# EAGLE schematic V1 (EAGLE 9.6.0)
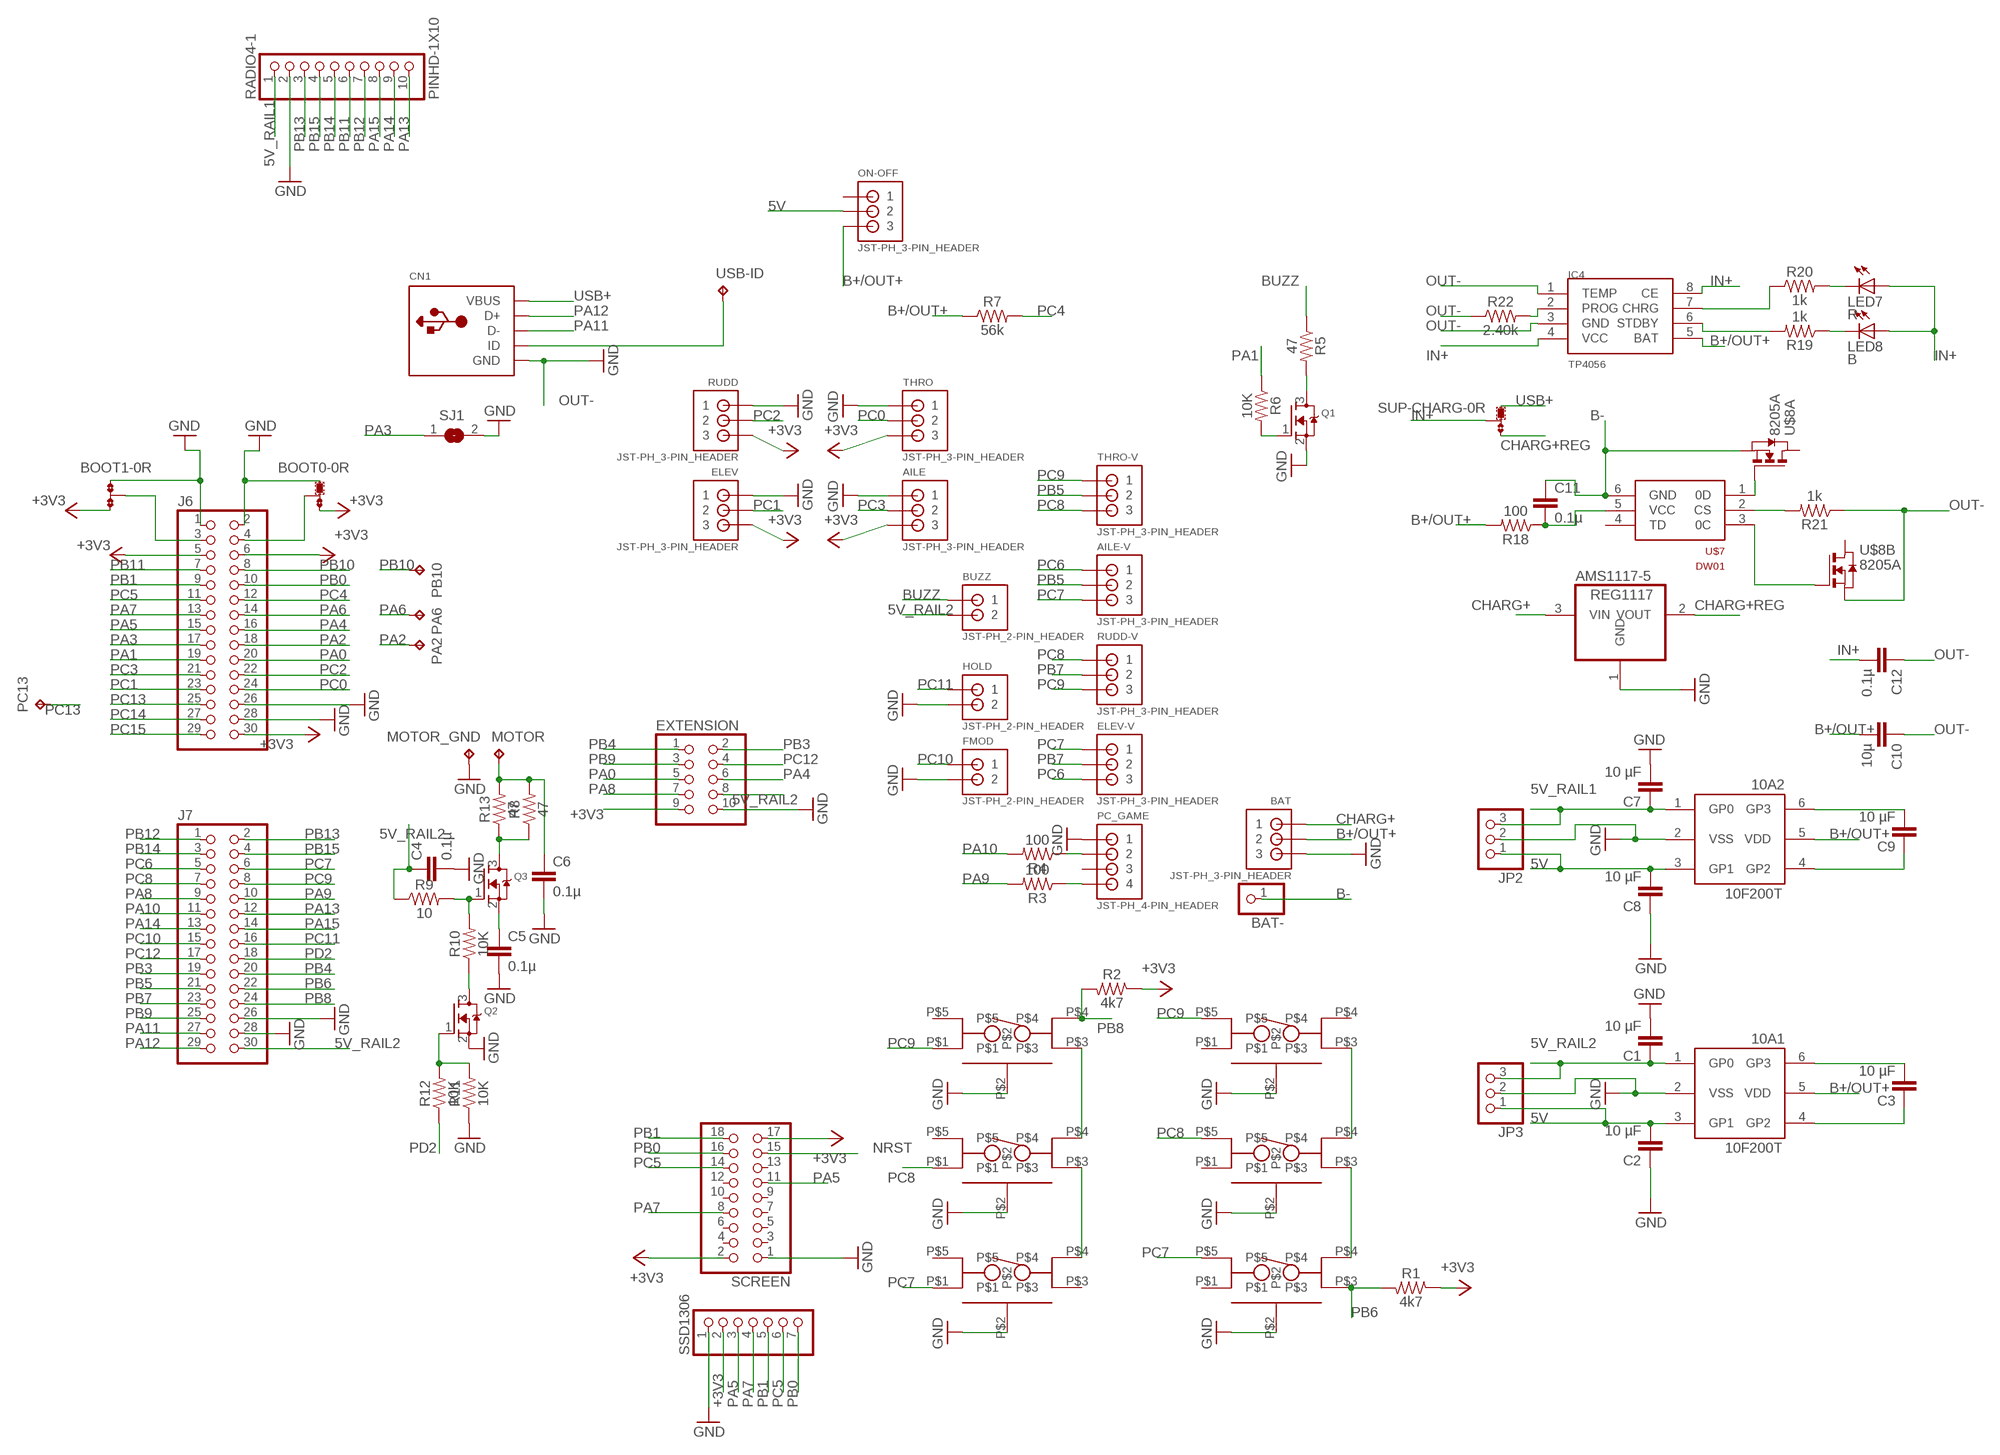
[diagram p0: schematic, sheet 1]

## Parts
10A1  10F200T  [SOT23-6]
10A2  10F200T  [SOT23-6]
AILE  JST-PH_3-PIN_HEADER  [JST_B3B-PH_HEADER]
AILE-V  JST-PH_3-PIN_HEADER  [JST_B3B-PH_HEADER]
AMS1117-5  REG1117  [SOT223]
BAT  JST-PH_3-PIN_HEADER  [JST_B3B-PH_HEADER]
BAT-  PINHD-1X1  [1X01]
BOOT0  0R-JUMPC  [C0R-JMP]
BOOT1  0R-JUMPC  [C0R-JMP]
BUZZ  JST-PH_2-PIN_HEADER  [JST_B2B-PH_HEADER]
C1  10 µF  CC0603  [C0603]
C2  10 µF  CC0603  [C0603]
C3  10 µF  CC0603  [C0603]
C4  0.1µ  C-EUC0603  [C0603]
C5  0.1µ  C-EUC0603  [C0603]
C6  0.1µ  C-EUC0603  [C0603]
C7  10 µF  CC0603  [C0603]
C8  10 µF  CC0603  [C0603]
C9  10 µF  CC0603  [C0603]
C10  10µ  C-EUC0603  [C0603]
C11  0.1µ  C-EUC0603  [C0603]
C12  0.1µ  C-EUC0603  [C0603]
CN1  USBMINIB  [USB-MINIB]
DN-  TS-1262V-5  [TS-1262V-5]
ELEV  JST-PH_3-PIN_HEADER  [JST_B3B-PH_HEADER]
ELEV-V  JST-PH_3-PIN_HEADER  [JST_B3B-PH_HEADER]
ENT  TS-1262V-5  [TS-1262V-5]
EXT  TS-1262V-5  [TS-1262V-5]
EXTENSION  PINHD-2X5  [2X05]
FMOD  JST-PH_2-PIN_HEADER  [JST_B2B-PH_HEADER]
HOLD  JST-PH_2-PIN_HEADER  [JST_B2B-PH_HEADER]
IC4  TP4056  [SOP-8]
J6  PINHD-2X15  [2X15]
J7  PINHD-2X15  [2X15]
JP2  PINHD-1X3  [1X03]
JP3  PINHD-1X3  [1X03]
L-  TS-1262V-5  [TS-1262V-5]
LED7  R  LEDCHIP-LED0603  [CHIP-LED0603]
LED8  B  LEDCHIP-LED0603  [CHIP-LED0603]
MOTOR  TPTP20R  [TP20R]
MOTOR_GND  TPTP20R  [TP20R]
ON-OFF  JST-PH_3-PIN_HEADER  [JST_B3B-PH_HEADER]
PA2  TPTP20R  [TP20R]
PA6  TPTP20R  [TP20R]
PB10  TPTP20R  [TP20R]
PC13  TPTP20R  [TP20R]
PC_GAME  JST-PH_4-PIN_HEADER  [JST_B4B-PH_HEADER]
Q1  MOSFET-NREFLOW  [SOT23]
Q2  MOSFET-NREFLOW  [SOT23]
Q3  MOSFET-NREFLOW  [SOT23]
R1  4k7  1KOHM-0603-1/10W-1%  [0603]
R2  4k7  1KOHM-0603-1/10W-1%  [0603]
R3  100  100OHM-0603-1/4W-5%  [0603]
R4  100  100OHM-0603-1/4W-5%  [0603]
R5  47  100OHM-0603-1/4W-5%  [0603]
R6  10K  100OHM-0603-1/4W-5%  [0603]
R7  56k  100OHM-0603-1/4W-5%  [0603]
R8  47  100OHM-0603-1/4W-5%  [0603]
R9  10  100OHM-0603-1/4W-5%  [0603]
R10  10K  100OHM-0603-1/4W-5%  [0603]
R11  10K  100OHM-0603-1/4W-5%  [0603]
R12  10K  100OHM-0603-1/4W-5%  [0603]
R13  47  100OHM-0603-1/4W-5%  [0603]
R18  100  100OHM-0603-1/4W-5%  [0603]
R19  1k  1KOHM-0603-1/10W-1%  [0603]
R20  1k  1KOHM-0603-1/10W-1%  [0603]
R21  1k  1KOHM-0603-1/10W-1%  [0603]
R22  2.40k  1.20KOHM-0603-1/10W-1%  [0603]
R+  TS-1262V-5  [TS-1262V-5]
RADIO4-1  PINHD-1X10  [1X10-BIG]
RUDD  JST-PH_3-PIN_HEADER  [JST_B3B-PH_HEADER]
RUDD-V  JST-PH_3-PIN_HEADER  [JST_B3B-PH_HEADER]
SCREEN  PINHD-2X9  [2X09]
SJ1  SJ  [SJ]
SSD1306  PINHD-1X7  [1X07]
SUP-CHARG  0R-JUMPC  [C0R-JMP]
THRO  JST-PH_3-PIN_HEADER  [JST_B3B-PH_HEADER]
THRO-V  JST-PH_3-PIN_HEADER  [JST_B3B-PH_HEADER]
U$7  DW01  [SOT23-6]
U$8  8205A  [TSSOP8]
UP+  TS-1262V-5  [TS-1262V-5]
USB-ID  TPTP20R  [TP20R]

## Nets
5V: 10A1.3(GP1) 10A2.3(GP1) C2.2 C8.2 JP2.1 JP3.1 ON-OFF.P2
5V_RAIL1: 10A2.1(GP0) C7.1 JP2.3 RADIO4-1.1
5V_RAIL2: 10A1.1(GP0) BUZZ.P2 C1.1 C4.1 EXTENSION.8 J7.30 JP3.3 R9.1
+3V3: AILE.P3 BOOT0.3 BOOT1.3 ELEV.P3 EXTENSION.9 J6.5 J6.6 J6.30 R1.1 R2.1 RUDD.P3 SCREEN.2 SCREEN.17 SSD1306.2 THRO.P3
B+/OUT+: 10A1.5(VDD) 10A2.5(VDD) BAT.P2 C10.2 IC4.5(BAT) ON-OFF.P3 R7.1 R18.2
B-: BAT-.1 C11.1 U$7.6(GND) U$8.2(A:S) U$8.3(A:S)
BUZZ: BUZZ.P1 R5.1
CHARG+: AMS1117-5.3(VIN) BAT.P1
CHARG+REG: AMS1117-5.2(VOUT) SUP-CHARG.3
GND: 10A1.2(VSS) 10A2.2(VSS) AILE.P1 AMS1117-5.1(GND) BAT.P3 BOOT0.1 BOOT1.1 C1.2 C2.1 C4.2 C5.2 C6.2 C7.2 C8.1 DN-.P$2 ELEV.P1 ENT.P$2 EXT.P$2 EXTENSION.10 FMOD.P2 HOLD.P2 J6.1 J6.2 J6.26 J6.28 J7.26 J7.28 JP2.2 JP3.2 L-.P$2 MOTOR_GND.TP PC_GAME.P1 Q1.2(S) Q2.2(S) R11.1 R+.P$2 RADIO4-1.2 RUDD.P1 SCREEN.1 SJ1.2 SSD1306.1 THRO.P1 UP+.P$2
IN+: C12.2 IC4.4(VCC) IC4.8(CE) LED7.A LED8.A SUP-CHARG.2
N$1: DN-.P$4 UP+.P$3
N$2: BOOT0.2 J6.4
N$3: BOOT1.2 J6.3
N$4: EXT.P$3 UP+.P$4
N$5: ENT.P$4 R+.P$3
N$6: L-.P$3 R+.P$4
N$7: 10A1.6(GP3) C3.2
N$8: Q2.3(D) R10.1
N$9: 10A1.4(GP2) C3.1
N$10: Q3.1(G) R9.2 R10.2
N$11: Q2.1(G) R11.2 R12.2
N$12: CN1.ID USB-ID.TP
N$13: PC_GAME.P2 R4.1
N$14: PC_GAME.P4 R3.1
N$15: Q1.3(D) R5.2
N$16: Q1.1(G) R6.2
N$17: C6.1 MOTOR.TP R8.2 R13.2
N$18: Q3.3(D) R8.1 R13.1
N$19: 10A2.6(GP3) C9.2
N$20: C5.1 Q3.2(S)
N$21: 10A2.4(GP2) C9.1
N$34: LED8.C R19.1
N$35: U$7.1(0D) U$8.4(A:G)
N$36: U$7.3(0C) U$8.5(B:G)
N$37: R21.2 U$7.2(CS)
N$38: C11.2 R18.1 U$7.5(VCC)
N$39: IC4.6(STDBY) R19.2
N$40: IC4.7(CHRG) R20.1
N$41: LED7.C R20.2
N$42: IC4.2(PROG) R22.2
NRST: SCREEN.15
OUT-: C10.1 C12.1 CN1.GND IC4.1(TEMP) IC4.3(GND) R21.1 R22.1 U$8.6(B:S) U$8.7(B:S) ; supply symbol labelled GND
PA0: EXTENSION.5 J6.20
PA1: J6.19 R6.1
PA2: J6.18 PA2.TP
PA3: J6.17 SJ1.1
PA4: EXTENSION.6 J6.16
PA5: J6.15 SCREEN.11 SSD1306.3
PA6: J6.14 PA6.TP
PA7: J6.13 SCREEN.8 SSD1306.4
PA8: EXTENSION.7 J7.9
PA9: J7.10 R3.2
PA10: J7.11 R4.2
PA11: CN1.D- J7.27
PA12: CN1.D+ J7.29
PA13: J7.12 RADIO4-1.10
PA14: J7.13 RADIO4-1.9
PA15: J7.14 RADIO4-1.8
PB0: J6.10 SCREEN.16 SSD1306.7
PB1: J6.9 SCREEN.18 SSD1306.5
PB3: EXTENSION.2 J7.19
PB4: EXTENSION.1 J7.20
PB5: AILE-V.P2 J7.21 THRO-V.P2
PB6: ENT.P$3 J7.22 R1.2
PB7: ELEV-V.P2 J7.23 RUDD-V.P2
PB8: EXT.P$4 J7.24 R2.2
PB9: EXTENSION.3 J7.25
PB10: J6.8 PB10.TP
PB11: J6.7 RADIO4-1.6
PB12: J7.1 RADIO4-1.7
PB13: J7.2 RADIO4-1.3
PB14: J7.3 RADIO4-1.5
PB15: J7.4 RADIO4-1.4
PC0: J6.24 THRO.P2
PC1: ELEV.P2 J6.23
PC2: J6.22 RUDD.P2
PC3: AILE.P2 J6.21
PC4: J6.12 R7.2
PC5: J6.11 SCREEN.14 SSD1306.6
PC6: AILE-V.P1 ELEV-V.P3 J7.5
PC7: AILE-V.P3 DN-.P$1 ELEV-V.P1 ENT.P$5 J7.6
PC8: J7.7 R+.P$5 RUDD-V.P1 THRO-V.P3 UP+.P$1
PC9: EXT.P$1 J7.8 L-.P$5 RUDD-V.P3 THRO-V.P1
PC10: FMOD.P1 J7.15
PC11: HOLD.P1 J7.16
PC12: EXTENSION.4 J7.17
PC13: J6.25 PC13.TP
PC14: J6.27
PC15: J6.29
PD2: J7.18 R12.1
USB+: CN1.VBUS SUP-CHARG.1
Unconnected: DN-.P$3 DN-.P$5 ENT.P$1 EXT.P$5 L-.P$1 L-.P$4 ON-OFF.P1 PC_GAME.P3 R+.P$1 SCREEN.3 SCREEN.4 SCREEN.5 SCREEN.6 SCREEN.7 SCREEN.9 SCREEN.10 SCREEN.12 SCREEN.13 U$7.4(TD) U$8.1(A:D) U$8.8(B:D) UP+.P$5

## Library data of the parts
10A1 10A2 = adafruit:10F200T: PIC10F200/202/204/206 Ultra-small 8-bit PIC micros in SOT-23-6 and SOIC
AILE AILE-V BAT ELEV ELEV-V ON-OFF RUDD RUDD-V THRO THRO-V = srg:JST-PH_3-PIN_HEADER: 3-pin JST PH Shrouded Header, top entry P/N B3B-PH-K-S Mating connector PHR-3
AMS1117-5 = burr-brown:REG1117: 800mA and 1A Low Dropout (LDO) Positive Regulator 1.8V, 2.5V, 2.85V, 3.3V, 5V, and Adj; MPN: REG1117; OC_FARNELL: 1097566; OC_NEWARK: 14P6981
BAT- = adafruit:PINHD-1X1: Pin header 1x1 for 0.1" spacing With round pins
BOOT0 BOOT1 SUP-CHARG = jump-0r-smd:0R-JUMP: SMD 0R 0805 Jumper
BUZZ FMOD HOLD = srg:JST-PH_2-PIN_HEADER: 2-pin JST PH Shrouded Header, top entry P/N B2B-PH-K-S Mating connector PHR-2 Mating cable assembly: Sparkfun PRT-09914 <http://www.sparkfun.com/products/9914>
C1-C3 C7-C9 = eagle-ltspice:C: CAPACITOR, European symbol; SPICEMODEL: NONE; SPICEPREFIX: C
C4-C6 C10-C12 = rcl:C-EU: CAPACITOR, European symbol
CN1 = adafruit:USB: USB Connectors USBMINIB - Surface Mount Female Mini-B USB Connector 4UConnector: 06564 By microbuilder.eu Thru-hole RA Female Mini-B USB Connector 4UConnector: 18732 By ladyada.net
DN- ENT EXT L- R+ UP+ = switchSMD:TS-1262V-5
EXTENSION = pinhead:PINHD-2X5: PIN HEADER
IC4 = TP4056:TP4056; OC_FARNELL: unknown
J6 J7 = pinhead:PINHD-2X15: PIN HEADER
JP2 JP3 = adafruit:PINHD-1X3: PIN HEADER
LED7 LED8 = led:LED: LED OSRAM: - CHIPLED LG R971, LG N971, LY N971, LG Q971, LY Q971, LO R971, LY R971 LH N974, LH R974 LS Q976, LO Q976, LY Q976 LO Q996 - Hyper CHIPLED LW Q18S LB Q993, LB Q99A, LB R99A - SideLED LS A670, LO A670, LY A670, LG A670, LP A670 LB A673, LV A673, LT A673, LW A673 LH A674 LY A675 LS A676, LA A676, LO A676, LY A676, LW A676 LS A679, LY A679, LG A679 - Hyper Micro SIDELED® LS Y876, LA Y876, LO Y876, LY Y876 LT Y87S - SmartLED LW L88C, LW L88S LB L89C, LB L89S, LG L890 LS L89K, LO L89K, LY L89K LS L896, LA L896, LO L896, LY L896 - TOPLED LS T670, LO T670, LY T670, LG T670, LP T670 LSG T670, LSP T670, LSY T670, LOP T670, LYG T670 LG T671, LOG T671, LSG T671 LB T673, LV T673, LT T673, LW T673 LH T674 LS T676, LA T676, LO T676, LY T676, LB T676, LH T676, LSB T676, LW T676 LB T67C, LV T67C, LT T67C, LS T67K, LO T67K, LY T67K, LW E67C LS E67B, LA E67B, LO E67B, LY E67B, LB E67C, LV E67C, LT E67C LW T67C LS T679, LY T679, LG T679 LS T770, LO T770, LY T770, LG T770, LP T770 LB T773, LV T773, LT T773, LW T773 LH T774 LS E675, LA E675, LY E675, LS T675 LS T776, LA T776, LO T776, LY T776, LB T776 LHGB T686 LT T68C, LB T68C - Hyper Mini TOPLED® LB M676 - Mini TOPLED Santana® LG M470 LS M47K, LO M47K, LY M47K Source: http://www.osram.convergy.de LUXEON: - LUMILED® LXK2-PW12-R00, LXK2-PW12-S00, LXK2-PW14-U00, LXK2-PW14-V00 LXK2-PM12-R00, LXK2-PM12-S00, LXK2-PM14-U00 LXK2-PE12-Q00, LXK2-PE12-R00, LXK2-PE12-S00, LXK2-PE14-T00, LXK2-PE14-U00 LXK2-PB12-K00, LXK2-PB12-L00, LXK2-PB12-M00, LXK2-PB14-N00, LXK2-PB14-P00, LXK2-PB14-Q00 LXK2-PR12-L00, LXK2-PR12-M00, LXK2-PR14-Q00, LXK2-PR14-R00 LXK2-PD12-Q00, LXK2-PD12-R00, LXK2-PD12-S00 LXK2-PH12-R00, LXK2-PH12-S00 LXK2-PL12-P00, LXK2-PL12-Q00, LXK2-PL12-R00 Source: www.luxeon.com KINGBRIGHT: KA-3528ASYC Source: www.kingbright.com
MOTOR MOTOR_GND PA2 PA6 PB10 PC13 USB-ID = testpad:TP: Test pad
PC_GAME = srg:JST-PH_4-PIN_HEADER: 4-pin JST PH Shrouded Header, top entry P/N B4B-PH-K-S Mating connector PHR-4 Mating cable assembly: Sparkfun PRT-09916 <http://www.sparkfun.com/products/9916>
Q1-Q3 = adafruit:MOSFET-N: N-Channel Mosfet 2N7002E - 60V 260mA SOT23 [Digikey: 2N7002ET1GOSTR-ND] - REEL BSH103 - 30V 850mA SOT23 [Digikey: 568-5013-1-ND]
R1 R2 = SparkFun-Resistors:1KOHM: 1kΩ resistor A resistor is a passive two-terminal electrical component that implements electrical resistance as a circuit element. Resistors act to reduce current flow, and, at the same time, act to lower voltage levels within circuits. - Wikipedia; PROD_ID: RES-07856; VALUE: 1k
R3 R4 R18 = Resistor_Sparkfun_master:100OHM: 100Ω resistor A resistor is a passive two-terminal electrical component that implements electrical resistance as a circuit element. Resistors act to reduce current flow, and, at the same time, act to lower voltage levels within circuits. - Wikipedia; PROD_ID: RES-12438
R5-R13 = Resistor_Sparkfun_master:100OHM: 100Ω resistor A resistor is a passive two-terminal electrical component that implements electrical resistance as a circuit element. Resistors act to reduce current flow, and, at the same time, act to lower voltage levels within circuits. - Wikipedia; PROD_ID: RES-12438; VALUE: 100
R19-R21 = Resistor_Sparkfun_master:1KOHM: 1kΩ resistor A resistor is a passive two-terminal electrical component that implements electrical resistance as a circuit element. Resistors act to reduce current flow, and, at the same time, act to lower voltage levels within circuits. - Wikipedia; PROD_ID: RES-07856
R22 = Resistor_Sparkfun_master:1.20KOHM: 1.20kΩ resistor A resistor is a passive two-terminal electrical component that implements electrical resistance as a circuit element. Resistors act to reduce current flow, and, at the same time, act to lower voltage levels within circuits. - Wikipedia; PROD_ID: RES-08413; VALUE: 1.20k
RADIO4-1 = adafruit:PINHD-1X10: Pin header 1x10 0.1" spacing With round pins
SCREEN = pinhead:PINHD-2X9: PIN HEADER
SJ1 = jumper:SJ: SMD solder JUMPER
SSD1306 = pinhead:PINHD-1X7: PIN HEADER
U$7 = DW01:DW01: The DW01-P battery protection IC is designed to protect lithium-ion/polymer battery from damage or degrading the lifetime due to overcharge, overdischarge, and/or overcurrent for one-cell lithium-ion/polymer battery powered systems, such as cellular phones. Data sheet <http://goo.gl/4y108d> Dave.Calaway Eagle Library <https://goo.gl/Muy1Tr>
U$8 = lipo:8205A: DUAL N-CHANNEL MOSFET The 8205A uses advanced trench technology to provide excellent RDS(ON), low gate charge and operation with gate voltages as low as 2.5V. This device is suitable for use as a Battery protection or in other Switching application.